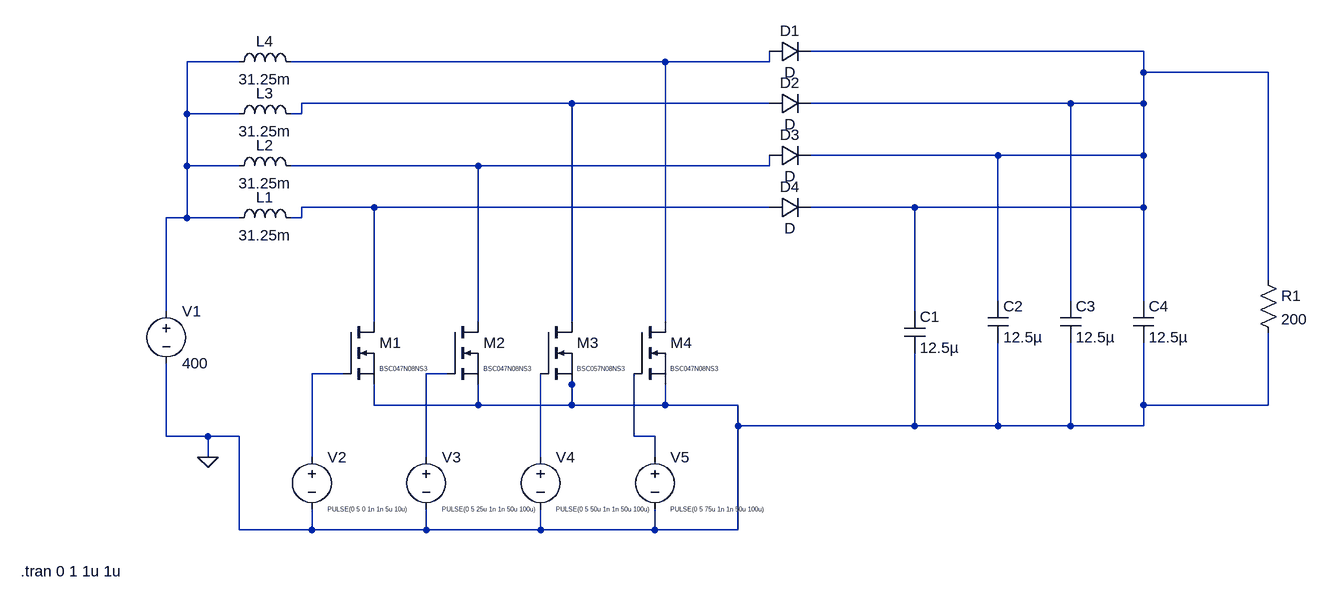
[diagram p0: schematic FLIBC.asc]
FLIBC.asc, the LTspice schematic file:
Version 4
SHEET 1 1748 680
WIRE 1488 -272 976 -272
WIRE 96 -256 16 -256
WIRE 752 -256 176 -256
WIRE 912 -256 912 -272
WIRE 912 -256 752 -256
WIRE 1488 -240 1488 -272
WIRE 1680 -240 1488 -240
WIRE 608 -192 192 -192
WIRE 912 -192 608 -192
WIRE 1376 -192 976 -192
WIRE 1488 -192 1488 -240
WIRE 1488 -192 1376 -192
WIRE 16 -176 16 -256
WIRE 96 -176 16 -176
WIRE 192 -176 192 -192
WIRE 192 -176 176 -176
WIRE 1264 -112 976 -112
WIRE 1488 -112 1488 -192
WIRE 1488 -112 1264 -112
WIRE 16 -96 16 -176
WIRE 96 -96 16 -96
WIRE 464 -96 176 -96
WIRE 912 -96 912 -112
WIRE 912 -96 464 -96
WIRE 304 -32 192 -32
WIRE 912 -32 304 -32
WIRE 1136 -32 976 -32
WIRE 1488 -32 1488 -112
WIRE 1488 -32 1136 -32
WIRE 16 -16 16 -96
WIRE 16 -16 -16 -16
WIRE 96 -16 16 -16
WIRE 192 -16 192 -32
WIRE 192 -16 176 -16
WIRE 1680 80 1680 -240
WIRE 1264 112 1264 -112
WIRE 1376 112 1376 -192
WIRE 1488 112 1488 -32
WIRE -16 128 -16 -16
WIRE 1136 128 1136 -32
WIRE 304 144 304 -32
WIRE 464 144 464 -96
WIRE 608 144 608 -192
WIRE 752 144 752 -256
WIRE 256 224 208 224
WIRE 416 224 384 224
WIRE 608 240 608 224
WIRE 304 272 304 240
WIRE 464 272 464 240
WIRE 464 272 304 272
WIRE 608 272 608 240
WIRE 608 272 464 272
WIRE 752 272 752 240
WIRE 752 272 608 272
WIRE 864 272 752 272
WIRE 1488 272 1488 176
WIRE 1680 272 1680 160
WIRE 1680 272 1488 272
WIRE 864 304 864 272
WIRE 1136 304 1136 192
WIRE 1136 304 864 304
WIRE 1264 304 1264 176
WIRE 1264 304 1136 304
WIRE 1376 304 1376 176
WIRE 1376 304 1264 304
WIRE 1488 304 1488 272
WIRE 1488 304 1376 304
WIRE -16 320 -16 208
WIRE 48 320 -16 320
WIRE 96 320 48 320
WIRE 704 320 704 224
WIRE 736 320 704 320
WIRE 48 352 48 320
WIRE 208 352 208 224
WIRE 384 352 384 224
WIRE 560 352 560 224
WIRE 736 352 736 320
WIRE 96 464 96 320
WIRE 208 464 208 432
WIRE 208 464 96 464
WIRE 384 464 384 432
WIRE 384 464 208 464
WIRE 560 464 560 432
WIRE 560 464 384 464
WIRE 736 464 736 432
WIRE 736 464 560 464
WIRE 864 464 864 304
WIRE 864 464 736 464
FLAG 48 352 0
SYMBOL voltage -16 112 R0
WINDOW 123 0 0 Left 0
WINDOW 39 0 0 Left 0
SYMATTR InstName V1
SYMATTR Value 400
SYMBOL ind 80 0 R270
WINDOW 0 32 56 VTop 2
WINDOW 3 5 56 VBottom 2
SYMATTR InstName L1
SYMATTR Value 31.25m
SYMBOL ind 80 -80 R270
WINDOW 0 32 56 VTop 2
WINDOW 3 5 56 VBottom 2
SYMATTR InstName L2
SYMATTR Value 31.25m
SYMBOL ind 80 -160 R270
WINDOW 0 32 56 VTop 2
WINDOW 3 5 56 VBottom 2
SYMATTR InstName L3
SYMATTR Value 31.25m
SYMBOL ind 80 -240 R270
WINDOW 0 32 56 VTop 2
WINDOW 3 5 56 VBottom 2
SYMATTR InstName L4
SYMATTR Value 31.25m
SYMBOL diode 912 -256 R270
WINDOW 0 32 32 VTop 2
WINDOW 3 0 32 VBottom 2
SYMATTR InstName D1
SYMBOL diode 912 -176 R270
WINDOW 0 32 32 VTop 2
WINDOW 3 0 32 VBottom 2
SYMATTR InstName D2
SYMBOL diode 912 -96 R270
WINDOW 0 32 32 VTop 2
WINDOW 3 0 32 VBottom 2
SYMATTR InstName D3
SYMBOL diode 912 -16 R270
WINDOW 0 32 32 VTop 2
WINDOW 3 0 32 VBottom 2
SYMATTR InstName D4
SYMBOL nmos 256 144 R0
WINDOW 3 56 72 Left 0
SYMATTR Value BSC047N08NS3
SYMATTR InstName M1
SYMBOL nmos 416 144 R0
WINDOW 3 56 72 Left 0
SYMATTR Value BSC047N08NS3
SYMATTR InstName M2
SYMBOL nmos 560 144 R0
WINDOW 3 56 72 Left 0
SYMATTR Value BSC057N08NS3
SYMATTR InstName M3
SYMBOL nmos 704 144 R0
WINDOW 3 56 72 Left 0
SYMATTR Value BSC047N08NS3
SYMATTR InstName M4
SYMBOL cap 1120 128 R0
SYMATTR InstName C1
SYMATTR Value 12.5µ
SYMBOL cap 1248 112 R0
SYMATTR InstName C2
SYMATTR Value 12.5µ
SYMBOL cap 1360 112 R0
SYMATTR InstName C3
SYMATTR Value 12.5µ
SYMBOL cap 1472 112 R0
SYMATTR InstName C4
SYMATTR Value 12.5µ
SYMBOL voltage 208 336 R0
WINDOW 3 24 96 Left 0
WINDOW 123 0 0 Left 0
WINDOW 39 0 0 Left 0
SYMATTR Value PULSE(0 5 0 1n 1n 5u 10u)
SYMATTR InstName V2
SYMBOL voltage 384 336 R0
WINDOW 3 24 96 Left 0
WINDOW 123 0 0 Left 0
WINDOW 39 0 0 Left 0
SYMATTR Value PULSE(0 5 25u 1n 1n 50u 100u)
SYMATTR InstName V3
SYMBOL voltage 560 336 R0
WINDOW 3 24 96 Left 0
WINDOW 123 0 0 Left 0
WINDOW 39 0 0 Left 0
SYMATTR Value PULSE(0 5 50u 1n 1n 50u 100u)
SYMATTR InstName V4
SYMBOL voltage 736 336 R0
WINDOW 3 24 96 Left 0
WINDOW 123 0 0 Left 0
WINDOW 39 0 0 Left 0
SYMATTR Value PULSE(0 5 75u 1n 1n 50u 100u)
SYMATTR InstName V5
SYMBOL res 1664 64 R0
SYMATTR InstName R1
SYMATTR Value 200
TEXT -240 528 Left 2 !.tran 0 1 1u 1u

The netlist it stands for:
* FLIBC.asc
V1 N002 0 400
L1 N002 N006 31.25m
L2 N002 N005 31.25m
L3 N002 N004 31.25m
L4 N002 N003 31.25m
D1 N003 N001 D
D2 N004 N001 D
D3 N005 N001 D
D4 N006 N001 D
M1 N006 N007 0 0 BSC047N08NS3
M2 N005 N008 0 0 BSC047N08NS3
M3 N004 N010 0 0 BSC057N08NS3
M4 N003 N009 0 0 BSC047N08NS3
C1 N001 0 12.5µ
C2 N001 0 12.5µ
C3 N001 0 12.5µ
C4 N001 0 12.5µ
V2 N007 0 PULSE(0 5 0 1n 1n 5u 10u)
V3 N008 0 PULSE(0 5 25u 1n 1n 50u 100u)
V4 N010 0 PULSE(0 5 50u 1n 1n 50u 100u)
V5 N009 0 PULSE(0 5 75u 1n 1n 50u 100u)
R1 N001 0 200
.model D D
.lib standard.dio
.model NMOS NMOS
.model PMOS PMOS
.lib standard.mos
.tran 0 1 1u 1u
.backanno
.end